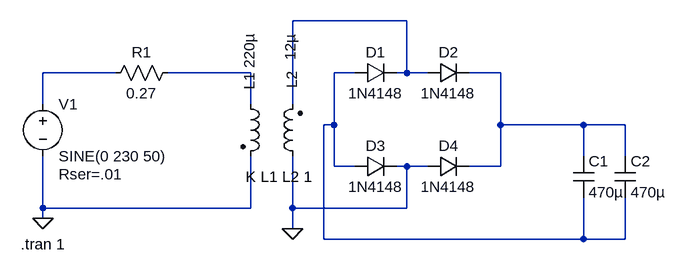
[diagram p0: schematic ACtoDC.asc]
ACtoDC.asc, the LTspice schematic file:
Version 4
SHEET 1 1000 680
WIRE 592 0 416 0
WIRE 144 80 32 80
WIRE 352 80 224 80
WIRE 512 80 480 80
WIRE 592 80 592 0
WIRE 592 80 576 80
WIRE 624 80 592 80
WIRE 736 80 688 80
WIRE 32 128 32 80
WIRE 352 128 352 80
WIRE 416 128 416 0
WIRE 480 160 480 80
WIRE 480 160 464 160
WIRE 736 160 736 80
WIRE 864 160 736 160
WIRE 928 160 864 160
WIRE 864 208 864 160
WIRE 928 208 928 160
WIRE 480 224 480 160
WIRE 512 224 480 224
WIRE 592 224 576 224
WIRE 624 224 592 224
WIRE 736 224 736 160
WIRE 736 224 688 224
WIRE 32 288 32 208
WIRE 352 288 352 208
WIRE 352 288 32 288
WIRE 416 288 416 208
WIRE 592 288 592 224
WIRE 592 288 416 288
WIRE 32 304 32 288
WIRE 416 320 416 288
WIRE 464 336 464 160
WIRE 864 336 864 272
WIRE 864 336 464 336
WIRE 928 336 928 272
WIRE 928 336 864 336
FLAG 32 304 0
FLAG 416 320 0
SYMBOL voltage 32 112 R0
WINDOW 123 0 0 Left 2
WINDOW 39 24 124 Left 2
SYMATTR InstName V1
SYMATTR Value SINE(0 230 50)
SYMATTR SpiceLine Rser=.01
SYMBOL res 240 64 R90
WINDOW 0 0 56 VBottom 2
WINDOW 3 32 56 VTop 2
SYMATTR InstName R1
SYMATTR Value 0.27
SYMBOL ind2 336 112 R0
WINDOW 0 14 -6 VLeft 2
WINDOW 3 14 -39 VLeft 2
SYMATTR InstName L1
SYMATTR Value 220µ
SYMATTR Type ind
SYMBOL ind2 432 224 R180
WINDOW 0 17 120 VRight 2
WINDOW 3 19 163 VRight 2
SYMATTR InstName L2
SYMATTR Value 12µ
SYMATTR Type ind
SYMBOL diode 512 96 R270
WINDOW 0 32 32 VTop 2
WINDOW 3 0 32 VBottom 2
SYMATTR InstName D1
SYMATTR Value 1N4148
SYMBOL diode 624 96 R270
WINDOW 0 32 32 VTop 2
WINDOW 3 0 32 VBottom 2
SYMATTR InstName D2
SYMATTR Value 1N4148
SYMBOL diode 512 240 R270
WINDOW 0 32 32 VTop 2
WINDOW 3 0 32 VBottom 2
SYMATTR InstName D3
SYMATTR Value 1N4148
SYMBOL diode 624 240 R270
WINDOW 0 32 32 VTop 2
WINDOW 3 0 32 VBottom 2
SYMATTR InstName D4
SYMATTR Value 1N4148
SYMBOL cap 848 208 R0
SYMATTR InstName C1
SYMATTR Value 470µ
SYMBOL cap 912 208 R0
SYMATTR InstName C2
SYMATTR Value 470µ
TEXT 344 240 Left 2 !K L1 L2 1
TEXT -2 344 Left 2 !.tran 1

The netlist it stands for:
* ACtoDC.asc
V1 N002 0 SINE(0 230 50) Rser=.01
R1 N003 N002 0.27
L1 N003 0 220µ
L2 0 N001 12µ
D1 N004 N001 1N4148
D2 N001 N005 1N4148
D3 N004 0 1N4148
D4 0 N005 1N4148
C1 N005 N004 470µ
C2 N005 N004 470µ
.model D D
.lib standard.dio
K L1 L2 1
.tran 1
.backanno
.end